# Altium schematic sheet 10_DDR3 RAM.SchDoc
size A3; SheetNumber: 10; SheetTotal: 14
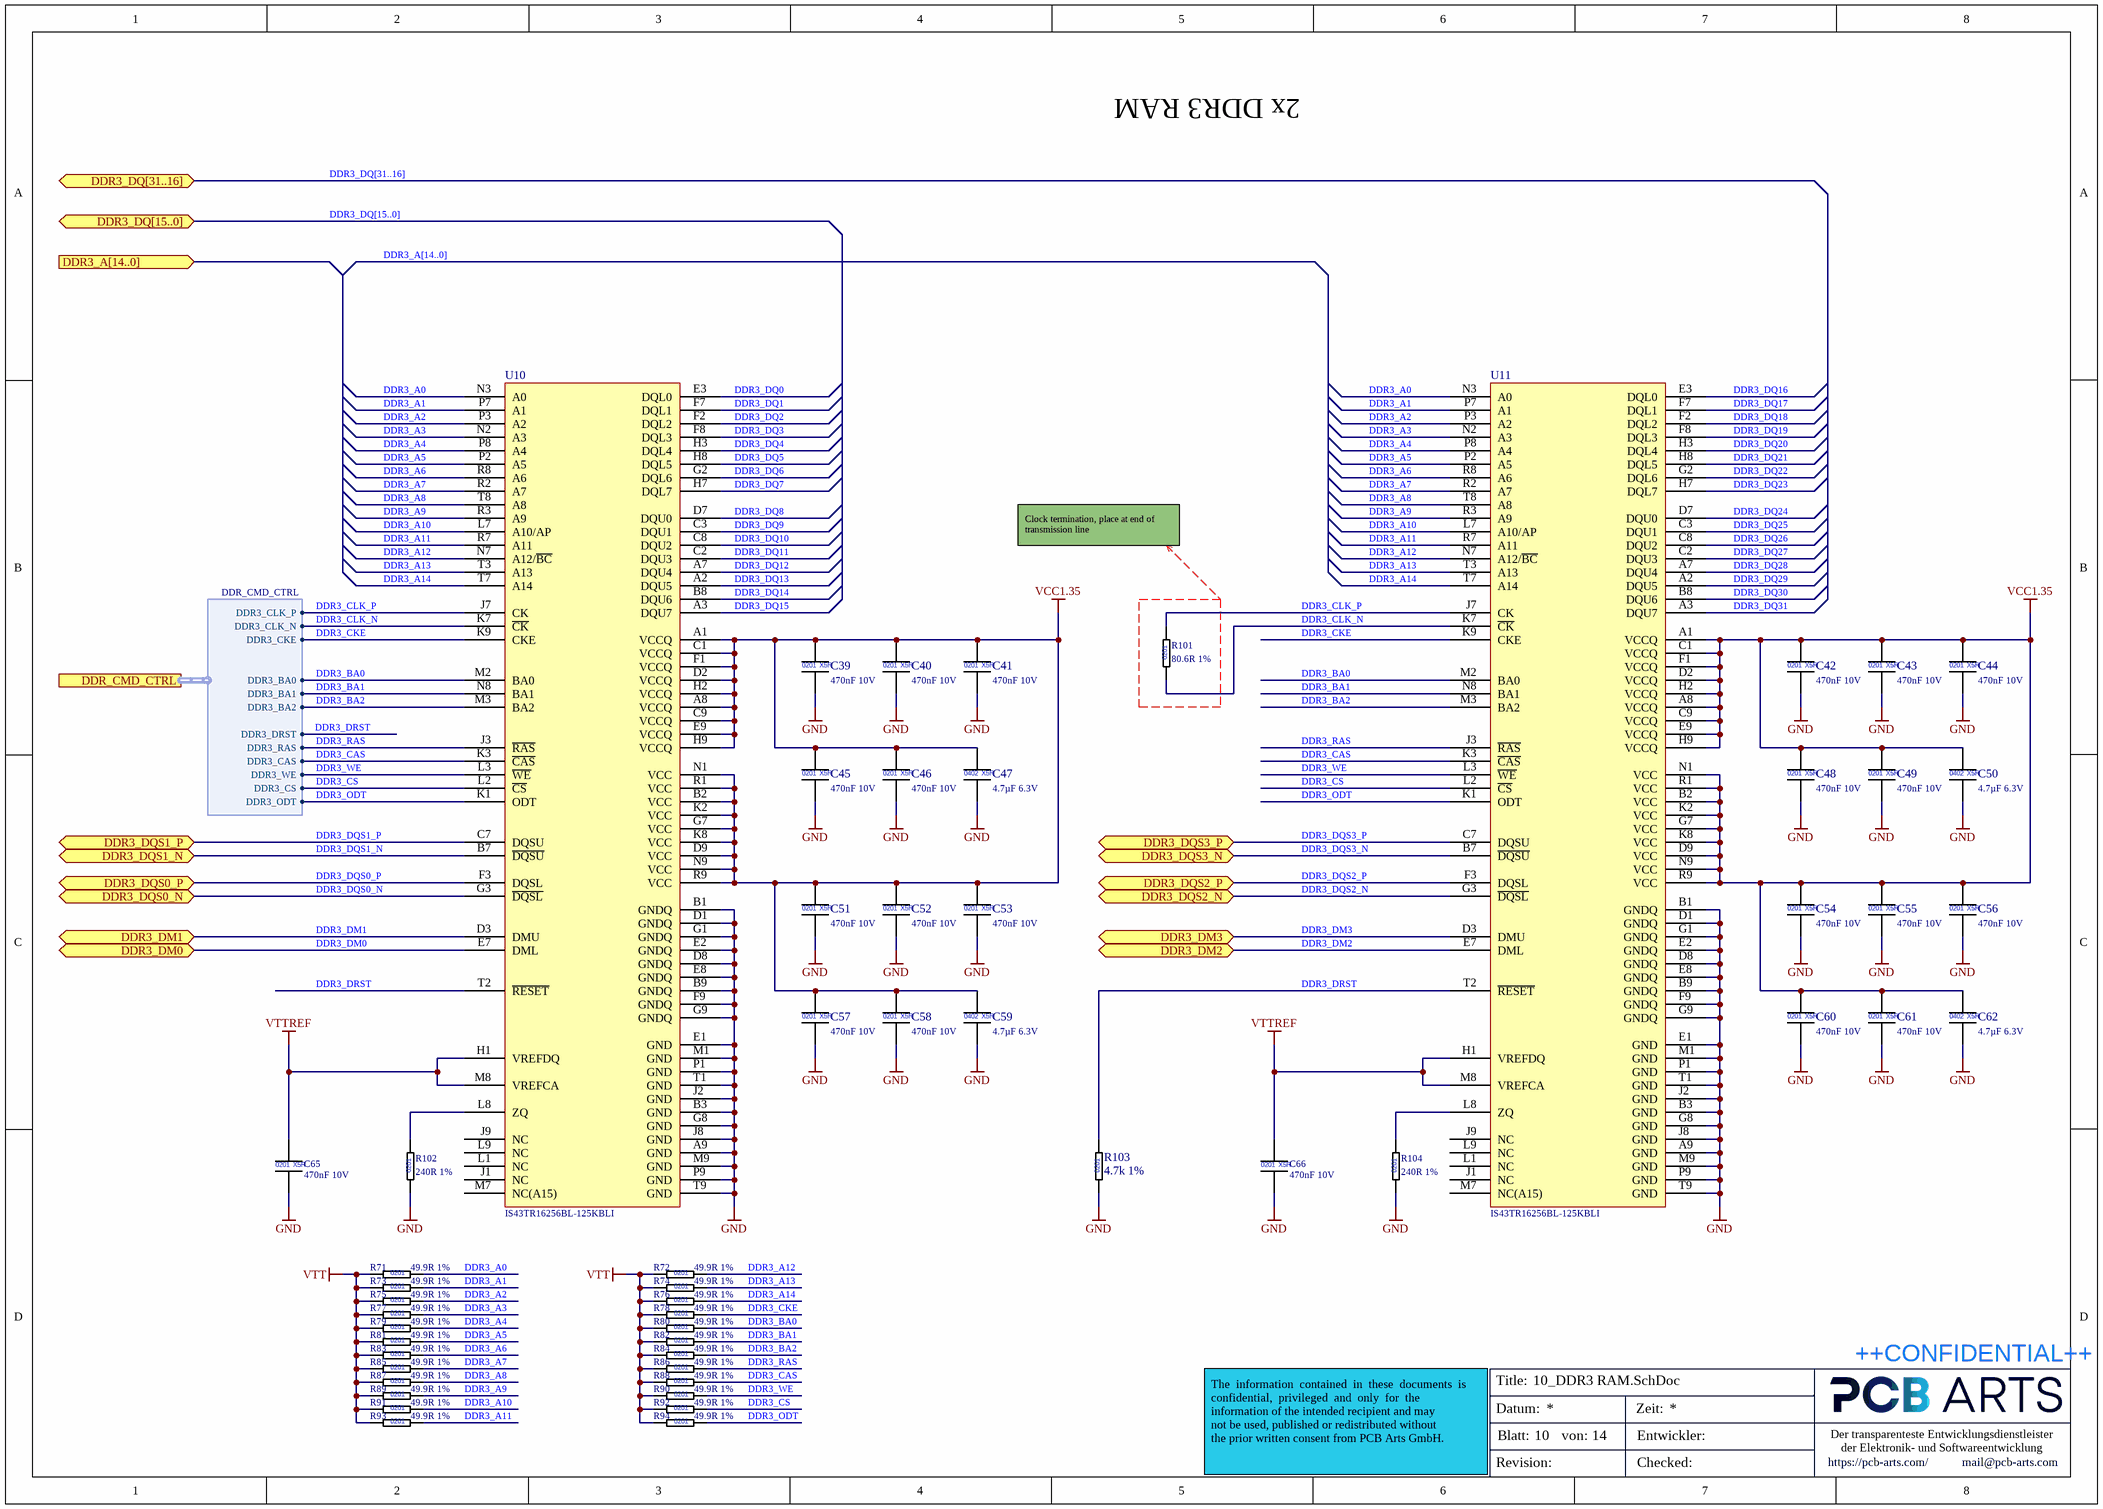
[diagram p0: 10_DDR3 RAM.SchDoc]

## Parts
C39  470nF 10V  [CAPC0603X03L]
C40  470nF 10V  [CAPC0603X03L]
C41  470nF 10V  [CAPC0603X03L]
C42  470nF 10V  [CAPC0603X03L]
C43  470nF 10V  [CAPC0603X03L]
C44  470nF 10V  [CAPC0603X03L]
C45  470nF 10V  [CAPC0603X03L]
C46  470nF 10V  [CAPC0603X03L]
C47  4.7µF 6.3V  [CAPC1005X06L]
C48  470nF 10V  [CAPC0603X03L]
C49  470nF 10V  [CAPC0603X03L]
C50  4.7µF 6.3V  [CAPC1005X06L]
C51  470nF 10V  [CAPC0603X03L]
C52  470nF 10V  [CAPC0603X03L]
C53  470nF 10V  [CAPC0603X03L]
C54  470nF 10V  [CAPC0603X03L]
C55  470nF 10V  [CAPC0603X03L]
C56  470nF 10V  [CAPC0603X03L]
C57  470nF 10V  [CAPC0603X03L]
C58  470nF 10V  [CAPC0603X03L]
C59  4.7µF 6.3V  [CAPC1005X06L]
C60  470nF 10V  [CAPC0603X03L]
C61  470nF 10V  [CAPC0603X03L]
C62  4.7µF 6.3V  [CAPC1005X06L]
C65  470nF 10V  [CAPC0603X03L]
C66  470nF 10V  [CAPC0603X03L]
R71  49.9R 1%  [RESC0603X03L]
R72  49.9R 1%  [RESC0603X03L]
R73  49.9R 1%  [RESC0603X03L]
R74  49.9R 1%  [RESC0603X03L]
R75  49.9R 1%  [RESC0603X03L]
R76  49.9R 1%  [RESC0603X03L]
R77  49.9R 1%  [RESC0603X03L]
R78  49.9R 1%  [RESC0603X03L]
R79  49.9R 1%  [RESC0603X03L]
R80  49.9R 1%  [RESC0603X03L]
R81  49.9R 1%  [RESC0603X03L]
R82  49.9R 1%  [RESC0603X03L]
R83  49.9R 1%  [RESC0603X03L]
R84  49.9R 1%  [RESC0603X03L]
R85  49.9R 1%  [RESC0603X03L]
R86  49.9R 1%  [RESC0603X03L]
R87  49.9R 1%  [RESC0603X03L]
R88  49.9R 1%  [RESC0603X03L]
R89  49.9R 1%  [RESC0603X03L]
R90  49.9R 1%  [RESC0603X03L]
R91  49.9R 1%  [RESC0603X03L]
R92  49.9R 1%  [RESC0603X03L]
R93  49.9R 1%  [RESC0603X03L]
R94  49.9R 1%  [RESC0603X03L]
R101  80.6R 1%  [RESC0603X03L]
R102  240R 1%  [RESC0603X03L]
R103  4.7k 1%  [RESC0603X03L]
R104  240R 1%  [RESC0603X03L]
U10  IS43TR16256BL-125KBLI  [BGA96C80P9X16_900X1300X120]
U11  IS43TR16256BL-125KBLI  [BGA96C80P9X16_900X1300X120]

## Ports
DDR3_A[14..0] (in), DDR3_DM0 (bidir), DDR3_DM1 (bidir), DDR3_DM2 (bidir), DDR3_DM3 (bidir), DDR3_DQ[15..0] (bidir), DDR3_DQ[31..16] (bidir), DDR3_DQS0_N (bidir), DDR3_DQS0_P (bidir), DDR3_DQS1_N (bidir), DDR3_DQS1_P (bidir), DDR3_DQS2_N (bidir), DDR3_DQS2_P (bidir), DDR3_DQS3_N (bidir), DDR3_DQS3_P (bidir), DDR_CMD_CTRL (harness DDR_CMD_CTRL)

## Harnesses
DDR_CMD_CTRL: DDR3_CLK_P, DDR3_CLK_N, DDR3_CKE, DDR3_BA0, DDR3_BA1, DDR3_RAS, DDR3_CS, DDR3_WE, DDR3_CAS, DDR3_BA2, DDR3_ODT, DDR3_DRST

## Nets
GND: C39.2 C40.2 C41.2 C42.2 C43.2 C44.2 C45.2 C46.2 C47.2 C48.2 C49.2 C50.2 C51.2 C52.2 C53.2 C54.2 C55.2 C56.2 C57.2 C58.2 C59.2 C60.2 C61.2 C62.2 C65.2 C66.2 R102.1 R103.1 R104.1 U10.A9(GND) U10.B1(GNDQ) U10.B3(GND) U10.B9(GNDQ) U10.D1(GNDQ) U10.D8(GNDQ) U10.E1(GND) U10.E2(GNDQ) U10.E8(GNDQ) U10.F9(GNDQ) U10.G1(GNDQ) U10.G8(GND) U10.G9(GNDQ) U10.J2(GND) U10.J8(GND) U10.M1(GND) U10.M9(GND) U10.P1(GND) U10.P9(GND) U10.T1(GND) U10.T9(GND) U11.A9(GND) U11.B1(GNDQ) U11.B3(GND) U11.B9(GNDQ) U11.D1(GNDQ) U11.D8(GNDQ) U11.E1(GND) U11.E2(GNDQ) U11.E8(GNDQ) U11.F9(GNDQ) U11.G1(GNDQ) U11.G8(GND) U11.G9(GNDQ) U11.J2(GND) U11.J8(GND) U11.M1(GND) U11.M9(GND) U11.P1(GND) U11.P9(GND) U11.T1(GND) U11.T9(GND)
VCC1.35: C39.1 C40.1 C41.1 C42.1 C43.1 C44.1 C45.1 C46.1 C47.1 C48.1 C49.1 C50.1 C51.1 C52.1 C53.1 C54.1 C55.1 C56.1 C57.1 C58.1 C59.1 C60.1 C61.1 C62.1 U10.A1(VCCQ) U10.A8(VCCQ) U10.B2(VCC) U10.C1(VCCQ) U10.C9(VCCQ) U10.D2(VCCQ) U10.D9(VCC) U10.E9(VCCQ) U10.F1(VCCQ) U10.G7(VCC) U10.H2(VCCQ) U10.H9(VCCQ) U10.K2(VCC) U10.K8(VCC) U10.N1(VCC) U10.N9(VCC) U10.R1(VCC) U10.R9(VCC) U11.A1(VCCQ) U11.A8(VCCQ) U11.B2(VCC) U11.C1(VCCQ) U11.C9(VCCQ) U11.D2(VCCQ) U11.D9(VCC) U11.E9(VCCQ) U11.F1(VCCQ) U11.G7(VCC) U11.H2(VCCQ) U11.H9(VCCQ) U11.K2(VCC) U11.K8(VCC) U11.N1(VCC) U11.N9(VCC) U11.R1(VCC) U11.R9(VCC)
VTT: R71.1 R72.1 R73.1 R74.1 R75.1 R76.1 R77.1 R78.1 R79.1 R80.1 R81.1 R82.1 R83.1 R84.1 R85.1 R86.1 R87.1 R88.1 R89.1 R90.1 R91.1 R92.1 R93.1 R94.1
VTTREF: C65.1 C66.1 U10.H1(VREFDQ) U10.M8(VREFCA) U11.H1(VREFDQ) U11.M8(VREFCA)
DDR3_A0: R71.2 U10.N3(A0) U11.N3(A0)
DDR3_A1: R73.2 U10.P7(A1) U11.P7(A1)
DDR3_A2: R75.2 U10.P3(A2) U11.P3(A2)
DDR3_A3: R77.2 U10.N2(A3) U11.N2(A3)
DDR3_A4: R79.2 U10.P8(A4) U11.P8(A4)
DDR3_A5: R81.2 U10.P2(A5) U11.P2(A5)
DDR3_A6: R83.2 U10.R8(A6) U11.R8(A6)
DDR3_A7: R85.2 U10.R2(A7) U11.R2(A7)
DDR3_A8: R87.2 U10.T8(A8) U11.T8(A8)
DDR3_A9: R89.2 U10.R3(A9) U11.R3(A9)
DDR3_A10: R91.2 U10.L7(A10/AP) U11.L7(A10/AP)
DDR3_A11: R93.2 U10.R7(A11) U11.R7(A11)
DDR3_A12: R72.2 U10.N7(A12/~{BC}) U11.N7(A12/~{BC})
DDR3_A13: R74.2 U10.T3(A13) U11.T3(A13)
DDR3_A14: R76.2 U10.T7(A14) U11.T7(A14)
DDR3_BA0: R80.2 U10.M2(BA0) U11.M2(BA0) ; port DDR_CMD_CTRL.DDR3_BA0
DDR3_BA1: R82.2 U10.N8(BA1) U11.N8(BA1) ; port DDR_CMD_CTRL.DDR3_BA1
DDR3_BA2: R84.2 U10.M3(BA2) U11.M3(BA2) ; port DDR_CMD_CTRL.DDR3_BA2
DDR3_CAS: R88.2 U10.K3(~{CAS}) U11.K3(~{CAS}) ; port DDR_CMD_CTRL.DDR3_CAS
DDR3_CKE: R78.2 U10.K9(CKE) U11.K9(CKE) ; port DDR_CMD_CTRL.DDR3_CKE
DDR3_CLK_N: R101.1 U10.K7(~{CK}) U11.K7(~{CK}) ; port DDR_CMD_CTRL.DDR3_CLK_N
DDR3_CLK_P: R101.2 U10.J7(CK) U11.J7(CK) ; port DDR_CMD_CTRL.DDR3_CLK_P
DDR3_CS: R92.2 U10.L2(~{CS}) U11.L2(~{CS}) ; port DDR_CMD_CTRL.DDR3_CS
DDR3_DM0: U10.E7(DML) ; port DDR3_DM0
DDR3_DM1: U10.D3(DMU) ; port DDR3_DM1
DDR3_DM2: U11.E7(DML) ; port DDR3_DM2
DDR3_DM3: U11.D3(DMU) ; port DDR3_DM3
DDR3_DQ0: U10.E3(DQL0)
DDR3_DQ1: U10.F7(DQL1)
DDR3_DQ2: U10.F2(DQL2)
DDR3_DQ3: U10.F8(DQL3)
DDR3_DQ4: U10.H3(DQL4)
DDR3_DQ5: U10.H8(DQL5)
DDR3_DQ6: U10.G2(DQL6)
DDR3_DQ7: U10.H7(DQL7)
DDR3_DQ8: U10.D7(DQU0)
DDR3_DQ9: U10.C3(DQU1)
DDR3_DQ10: U10.C8(DQU2)
DDR3_DQ11: U10.C2(DQU3)
DDR3_DQ12: U10.A7(DQU4)
DDR3_DQ13: U10.A2(DQU5)
DDR3_DQ14: U10.B8(DQU6)
DDR3_DQ15: U10.A3(DQU7)
DDR3_DQ16: U11.E3(DQL0)
DDR3_DQ17: U11.F7(DQL1)
DDR3_DQ18: U11.F2(DQL2)
DDR3_DQ19: U11.F8(DQL3)
DDR3_DQ20: U11.H3(DQL4)
DDR3_DQ21: U11.H8(DQL5)
DDR3_DQ22: U11.G2(DQL6)
DDR3_DQ23: U11.H7(DQL7)
DDR3_DQ24: U11.D7(DQU0)
DDR3_DQ25: U11.C3(DQU1)
DDR3_DQ26: U11.C8(DQU2)
DDR3_DQ27: U11.C2(DQU3)
DDR3_DQ28: U11.A7(DQU4)
DDR3_DQ29: U11.A2(DQU5)
DDR3_DQ30: U11.B8(DQU6)
DDR3_DQ31: U11.A3(DQU7)
DDR3_DQS0_N: U10.G3(~{DQSL}) ; port DDR3_DQS0_N
DDR3_DQS0_P: U10.F3(DQSL) ; port DDR3_DQS0_P
DDR3_DQS1_N: U10.B7(~{DQSU}) ; port DDR3_DQS1_N
DDR3_DQS1_P: U10.C7(DQSU) ; port DDR3_DQS1_P
DDR3_DQS2_N: U11.G3(~{DQSL}) ; port DDR3_DQS2_N
DDR3_DQS2_P: U11.F3(DQSL) ; port DDR3_DQS2_P
DDR3_DQS3_N: U11.B7(~{DQSU}) ; port DDR3_DQS3_N
DDR3_DQS3_P: U11.C7(DQSU) ; port DDR3_DQS3_P
DDR3_DRST: R103.2 U10.T2(~{RESET}) U11.T2(~{RESET}) ; port DDR_CMD_CTRL.DDR3_DRST
DDR3_ODT: R94.2 U10.K1(ODT) U11.K1(ODT) ; port DDR_CMD_CTRL.DDR3_ODT
DDR3_RAS: R86.2 U10.J3(~{RAS}) U11.J3(~{RAS}) ; port DDR_CMD_CTRL.DDR3_RAS
DDR3_WE: R90.2 U10.L3(~{WE}) U11.L3(~{WE}) ; port DDR_CMD_CTRL.DDR3_WE
NetR102_2: R102.2 U10.L8(ZQ)
NetR104_2: R104.2 U11.L8(ZQ)

Not connected (* = marked no-connect by the designer): U10 J1(NC) J9(NC) L1(NC) L9(NC) M7(NC(A15)); U11 J1(NC) J9(NC) L1(NC) L9(NC) M7(NC(A15))

## Buses and harness runs
bus DDR3_A[14..0] = port DDR3_A[14..0]
bus DDR3_DQ[15..0] = port DDR3_DQ[15..0]
bus DDR3_DQ[31..16] = port DDR3_DQ[31..16]

## Notes on the sheet
- 2x DDR3 RAM
- Clock termination, place at end of transmission line
- Title:
- ++CONFIDENTIAL++
- Datum:
- Blatt:
- von:
- Zeit:
- Entwickler:
- Der transparenteste Entwicklungsdienstleister
  der Elektronik- und Softwareentwicklung
- The  information  contained  in  these  documents  is  confidential,  privileged  and  only  for  the
  information of the intended recipient and may
  not be used, published or redistributed without
  the prior written consent from PCB Arts GmbH.
- Revision:
- Checked:
- https://pcb-arts.com/
- mail@pcb-arts.com
- (in symbol CAP_0201_470nF_10V) 0201; X5R
- (in symbol CAP_0402_4.7µ_6.3V) 0402; X5R
- (in symbol RES_0201_4.7k_1%) 0201
- (in symbol RES_0201_49.9R_1%) 0201
- (in symbol RES_0201_80.6R_1%) 0201
- (in symbol RES_0201_240R_1%) 0201

## Library data of the parts
C39-C46 C48 C49 C51-C58 C60 C61 C65 C66 = CAP_0201_470nF_10V: Multilayer Ceramic Capacitors MLCC - SMD/SMT 0201 10VDC; Manufacturer 1: Taiyo Yuden; Manufacturer 1 Prt. Nr.: LMK063BBJ474KPLF; Manufacturer 2 Prt. Nr.: C0603X5R1A474M030BC; Manufacturer 2: TDK
C47 C50 C59 C62 = CAP_0402_4.7µ_6.3V: Multilayer Ceramic Capacitors MLCC - SMD/SMT 0402 6.3VDC; Manufacturer 1: Murata Electronics; Manufacturer 1 Prt. Nr.: GRM155R60J475ME47D; Manufacturer 2 Prt. Nr.: JMK105BC6475MV-F; Manufacturer 2: Taiyo Yuden
R71-R94 = RES_0201_49.9R_1%: Thick Film Resistors - SMD 49.9R OHM 1%; Manufacturer 1: Yageo; Manufacturer 1 Prt. Nr.: AC0201FR-0749R9L; Manufacturer 2 Prt. Nr.: CRCW020149R9FNED; Manufacturer 2: Vishay / Dale
R101 = RES_0201_80.6R_1%: Thick Film Resistors - SMD 80.6R OHM 1%; Manufacturer 1: Yageo; Manufacturer 1 Prt. Nr.: RC0201FR-0780R6L; Manufacturer 2 Prt. Nr.: CRCW020180R6FKED; Manufacturer 2: Vishay / Dale
R102 R104 = RES_0201_240R_1%: Thick Film Resistors - SMD 240 OHM 1%; Manufacturer 1: Yageo; Manufacturer 1 Prt. Nr.: RC0201FR-07240RL; Manufacturer 2 Prt. Nr.: CRCW0201240RFNED; Manufacturer 2: Vishay / Dale
R103 = RES_0201_4.7k_1%: Thick Film Resistors - SMD 4.7K OHM 1%; Manufacturer 1: Yageo; Manufacturer 1 Prt. Nr.: RC0201JR-074K7P; Manufacturer 2 Prt. Nr.: CRCW02014K70FNED; Manufacturer 2: Vishay / Dale
U10 U11 = IS43TR16256BL-125KBLI_DRAM 4G, 1.35V, DDR3L, 256Mx16: DRAM 4G, 1.35V, DDR3L, 256Mx16, 1600MT/s @ 11-11-11, 96 ball BGA (9mm x13mm) RoHS, IT; Manufacturer 1: ISSI; Manufacturer 1 Prt. Nr.: IS43TR16256BL-125KBLI